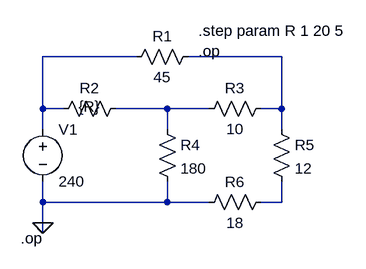
[diagram p0: schematic P_2-24.asc]
P_2-24.asc, the LTspice schematic file:
Version 4
SHEET 1 880 680
WIRE 160 80 16 80
WIRE 384 80 240 80
WIRE 16 160 16 80
WIRE 48 160 16 160
WIRE 208 160 128 160
WIRE 272 160 208 160
WIRE 384 160 384 80
WIRE 384 160 352 160
WIRE 16 192 16 160
WIRE 208 192 208 160
WIRE 384 192 384 160
WIRE 16 304 16 272
WIRE 208 304 208 272
WIRE 208 304 16 304
WIRE 272 304 208 304
WIRE 384 304 384 272
WIRE 384 304 352 304
WIRE 16 336 16 304
WIRE 16 352 16 336
FLAG 16 336 0
SYMBOL res 144 96 R270
WINDOW 0 32 56 VTop 2
WINDOW 3 0 56 VBottom 2
SYMATTR InstName R1
SYMATTR Value 45
SYMBOL res 32 176 R270
WINDOW 0 32 56 VTop 2
WINDOW 3 4 56 VTop 2
SYMATTR InstName R2
SYMATTR Value {R}
SYMBOL res 256 176 R270
WINDOW 0 32 56 VTop 2
WINDOW 3 0 56 VBottom 2
SYMATTR InstName R3
SYMATTR Value 10
SYMBOL res 192 176 R0
SYMATTR InstName R4
SYMATTR Value 180
SYMBOL res 368 176 R0
SYMATTR InstName R5
SYMATTR Value 12
SYMBOL res 256 320 R270
WINDOW 0 32 56 VTop 2
WINDOW 3 0 56 VBottom 2
SYMATTR InstName R6
SYMATTR Value 18
SYMBOL voltage 16 176 R0
WINDOW 123 0 0 Left 2
WINDOW 39 0 0 Left 2
SYMATTR InstName V1
SYMATTR Value 240
TEXT -18 360 Left 2 !.op
TEXT 256 40 Left 2 !.step param R 1 20 5\n.op

The netlist it stands for:
* P_2-24.asc
R1 N001 N002 45
R2 N001 N003 {R}
R3 N003 N002 10
R4 N003 0 180
R5 N002 N004 12
R6 0 N004 18
V1 N001 0 240
.op
.step param R 1 20 5
.op
.backanno
.end